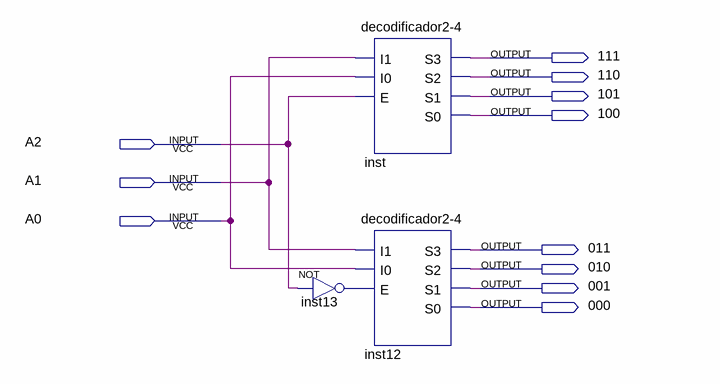
[diagram p0: schematic sheet]
// Quartus schematic decodificador3-8.bdf as structural Verilog: 3 symbols, 11 pins
module \decodificador3-8  (
  input  A2,
  input  A1,
  input  A0,
  output \111 ,
  output \110 ,
  output \101 ,
  output \100 ,
  output \011 ,
  output \010 ,
  output \001 ,
  output \000 
);

  wire inst13_out;

  \decodificador2-4  inst (.I1(A1), .I0(A0), .E(A2), .S3(\111 ), .S2(\110 ), .S1(\101 ), .S0(\100 ));
  \decodificador2-4  inst12 (.I1(A1), .I0(A0), .E(inst13_out), .S3(\011 ), .S2(\010 ), .S1(\001 ), .S0(\000 ));
  not inst13 (inst13_out, A2);
endmodule
